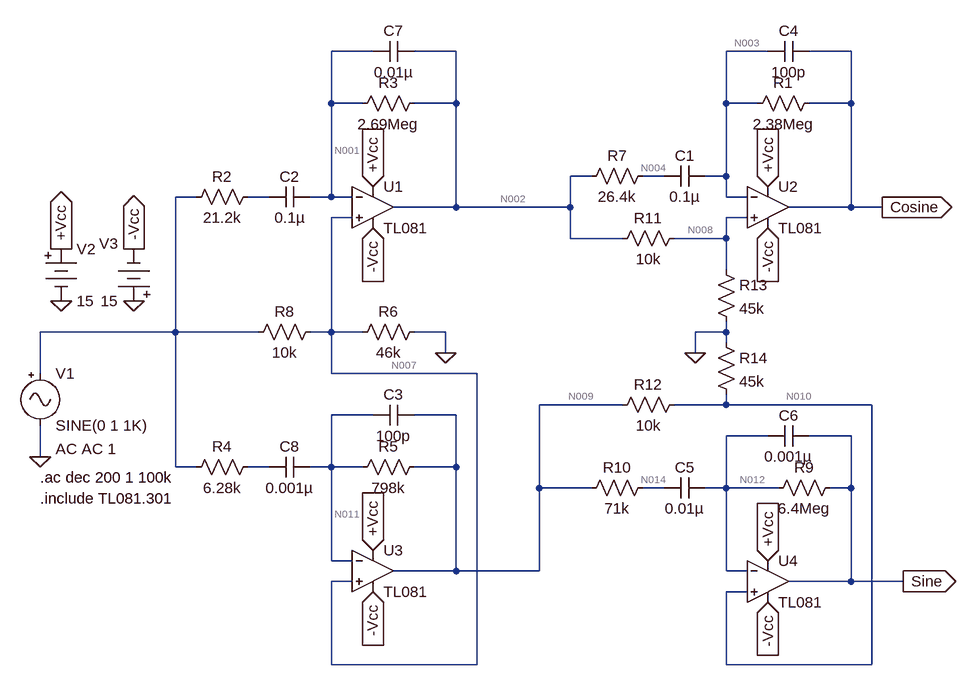
[diagram p0: schematic Second-Order Lloyd All-Pass.asc]
Second-Order Lloyd All-Pass.asc, the LTspice schematic file:
Version 4
SHEET 1 1304 1024
WIRE 32 -112 -32 -112
WIRE 160 -112 96 -112
WIRE 640 -112 576 -112
WIRE 768 -112 704 -112
WIRE -32 -32 -32 -112
WIRE 16 -32 -32 -32
WIRE 160 -32 160 -112
WIRE 160 -32 96 -32
WIRE 576 -32 576 -112
WIRE 624 -32 576 -32
WIRE 768 -32 768 -112
WIRE 768 -32 704 -32
WIRE 368 80 336 80
WIRE 480 80 448 80
WIRE 576 80 576 -32
WIRE 576 80 544 80
WIRE -240 112 -272 112
WIRE -128 112 -160 112
WIRE -32 112 -32 -32
WIRE -32 112 -64 112
WIRE 0 112 -32 112
WIRE 576 112 576 80
WIRE 608 112 576 112
WIRE 160 128 160 -32
WIRE 160 128 64 128
WIRE 336 128 336 80
WIRE 336 128 160 128
WIRE 768 128 768 -32
WIRE 768 128 672 128
WIRE 816 128 768 128
WIRE 0 144 -32 144
WIRE 608 144 576 144
WIRE 336 176 336 128
WIRE 416 176 336 176
WIRE 576 176 576 144
WIRE 576 176 496 176
WIRE 576 224 576 176
WIRE -272 320 -272 112
WIRE -272 320 -480 320
WIRE -144 320 -272 320
WIRE -32 320 -32 144
WIRE -32 320 -64 320
WIRE 16 320 -32 320
WIRE 144 320 96 320
WIRE 576 320 576 304
WIRE 576 320 528 320
WIRE 576 336 576 320
WIRE 144 352 144 320
WIRE 528 352 528 320
WIRE -480 384 -480 320
WIRE -32 384 -32 320
WIRE 192 384 -32 384
WIRE 416 432 288 432
WIRE 576 432 576 416
WIRE 576 432 496 432
WIRE 800 432 576 432
WIRE 32 448 -32 448
WIRE 160 448 96 448
WIRE 640 480 576 480
WIRE 768 480 704 480
WIRE -480 512 -480 464
WIRE -272 528 -272 320
WIRE -240 528 -272 528
WIRE -128 528 -160 528
WIRE -32 528 -32 448
WIRE -32 528 -64 528
WIRE 16 528 -32 528
WIRE 160 528 160 448
WIRE 160 528 96 528
WIRE 288 560 288 432
WIRE 368 560 288 560
WIRE 480 560 448 560
WIRE 576 560 576 480
WIRE 576 560 544 560
WIRE 656 560 576 560
WIRE 768 560 768 480
WIRE 768 560 736 560
WIRE -32 672 -32 528
WIRE 0 672 -32 672
WIRE 160 688 160 528
WIRE 160 688 64 688
WIRE 288 688 288 560
WIRE 288 688 160 688
WIRE 576 688 576 560
WIRE 608 688 576 688
WIRE 0 704 -32 704
WIRE 768 704 768 560
WIRE 768 704 672 704
WIRE 848 704 768 704
WIRE 608 720 576 720
WIRE -32 832 -32 704
WIRE 192 832 192 384
WIRE 192 832 -32 832
WIRE 576 832 576 720
WIRE 800 832 800 432
WIRE 800 832 576 832
FLAG 32 96 +Vcc
IOPIN 32 96 In
FLAG 32 160 -Vcc
IOPIN 32 160 In
FLAG -480 512 0
FLAG 32 656 +Vcc
IOPIN 32 656 In
FLAG 32 720 -Vcc
IOPIN 32 720 In
FLAG 848 704 Sine
IOPIN 848 704 Out
FLAG 816 128 Cosine
IOPIN 816 128 Out
FLAG -448 192 +Vcc
IOPIN -448 192 Out
FLAG -336 192 -Vcc
IOPIN -336 192 Out
FLAG -336 272 0
FLAG -448 272 0
FLAG 144 352 0
FLAG 640 96 +Vcc
IOPIN 640 96 In
FLAG 640 160 -Vcc
IOPIN 640 160 In
FLAG 640 672 +Vcc
IOPIN 640 672 In
FLAG 640 736 -Vcc
IOPIN 640 736 In
FLAG 528 352 0
SYMBOL OpAmps\\opamp2 32 64 R0
SYMATTR InstName U1
SYMATTR Value TL081
SYMBOL res 112 -48 R90
WINDOW 0 0 56 VBottom 2
WINDOW 3 32 56 VTop 2
SYMATTR InstName R3
SYMATTR Value 2.69Meg
SYMBOL Misc\\signal -480 368 R0
WINDOW 123 24 132 Left 2
WINDOW 39 0 0 Left 0
SYMATTR Value2 AC AC 1
SYMATTR InstName V1
SYMBOL res 112 304 R90
WINDOW 0 0 56 VBottom 2
WINDOW 3 32 56 VTop 2
SYMATTR InstName R6
SYMATTR Value 46k
SYMBOL res -48 304 R90
WINDOW 0 0 56 VBottom 2
WINDOW 3 32 56 VTop 2
SYMATTR InstName R8
SYMATTR Value 10k
SYMBOL Misc\\battery -448 176 R0
WINDOW 123 0 0 Left 0
WINDOW 39 0 0 Left 0
SYMATTR InstName V2
SYMATTR Value 15
SYMBOL Misc\\battery -336 288 R180
WINDOW 0 24 104 Left 2
WINDOW 3 24 16 Left 2
WINDOW 123 0 0 Left 0
WINDOW 39 0 0 Left 0
SYMATTR InstName V3
SYMATTR Value 15
SYMBOL cap -64 96 R90
WINDOW 0 0 32 VBottom 2
WINDOW 3 32 32 VTop 2
SYMATTR InstName C2
SYMATTR Value 0.1µ
SYMBOL res -144 96 R90
WINDOW 0 0 56 VBottom 2
WINDOW 3 32 56 VTop 2
SYMATTR InstName R2
SYMATTR Value 21.2k
SYMBOL cap 96 -128 R90
WINDOW 0 0 32 VBottom 2
WINDOW 3 32 32 VTop 2
SYMATTR InstName C7
SYMATTR Value 0.01µ
SYMBOL cap -64 512 R90
WINDOW 0 0 32 VBottom 2
WINDOW 3 32 32 VTop 2
SYMATTR InstName C8
SYMATTR Value 0.001µ
SYMBOL res -144 512 R90
WINDOW 0 0 56 VBottom 2
WINDOW 3 32 56 VTop 2
SYMATTR InstName R4
SYMATTR Value 6.28k
SYMBOL res 112 512 R90
WINDOW 0 0 56 VBottom 2
WINDOW 3 32 56 VTop 2
SYMATTR InstName R5
SYMATTR Value 798k
SYMBOL cap 96 432 R90
WINDOW 0 0 32 VBottom 2
WINDOW 3 32 32 VTop 2
SYMATTR InstName C3
SYMATTR Value 100p
SYMBOL OpAmps\\opamp2 640 64 R0
SYMATTR InstName U2
SYMATTR Value TL081
SYMBOL res 720 -48 R90
WINDOW 0 0 56 VBottom 2
WINDOW 3 32 56 VTop 2
SYMATTR InstName R1
SYMATTR Value 2.38Meg
SYMBOL cap 544 64 R90
WINDOW 0 0 32 VBottom 2
WINDOW 3 32 32 VTop 2
SYMATTR InstName C1
SYMATTR Value 0.1µ
SYMBOL res 464 64 R90
WINDOW 0 0 56 VBottom 2
WINDOW 3 32 56 VTop 2
SYMATTR InstName R7
SYMATTR Value 26.4k
SYMBOL res 512 160 R90
WINDOW 0 0 56 VBottom 2
WINDOW 3 32 56 VTop 2
SYMATTR InstName R11
SYMATTR Value 10k
SYMBOL res 752 544 R90
WINDOW 0 0 56 VBottom 2
WINDOW 3 32 56 VTop 2
SYMATTR InstName R9
SYMATTR Value 6.4Meg
SYMBOL cap 704 464 R90
WINDOW 0 0 32 VBottom 2
WINDOW 3 32 32 VTop 2
SYMATTR InstName C6
SYMATTR Value 0.001µ
SYMBOL cap 544 544 R90
WINDOW 0 0 32 VBottom 2
WINDOW 3 32 32 VTop 2
SYMATTR InstName C5
SYMATTR Value 0.01µ
SYMBOL res 464 544 R90
WINDOW 0 0 56 VBottom 2
WINDOW 3 32 56 VTop 2
SYMATTR InstName R10
SYMATTR Value 71k
SYMBOL res 512 416 R90
WINDOW 0 0 56 VBottom 2
WINDOW 3 32 56 VTop 2
SYMATTR InstName R12
SYMATTR Value 10k
SYMBOL res 560 208 R0
SYMATTR InstName R13
SYMATTR Value 45k
SYMBOL res 560 320 R0
SYMATTR InstName R14
SYMATTR Value 45k
SYMBOL cap 704 -128 R90
WINDOW 0 0 32 VBottom 2
WINDOW 3 32 32 VTop 2
SYMATTR InstName C4
SYMATTR Value 100p
SYMBOL OpAmps\\opamp2 32 624 R0
SYMATTR InstName U3
SYMATTR Value TL081
SYMBOL OpAmps\\opamp2 640 640 R0
SYMATTR InstName U4
SYMATTR Value TL081
TEXT -480 576 Left 2 !.include TL081.301
TEXT -480 544 Left 2 !.ac dec 200 1 100k

The netlist it stands for:
* Second-Order Lloyd All-Pass.asc
XU1 N007 N001 +Vcc -Vcc N002 TL081  ; pins In+ In- V+ V- OUT
R3 N002 N001 2.69Meg
V1 N005 0 SINE(0 1 1K) AC AC 1
R6 0 N007 46k
R8 N007 N005 10k
V2 +Vcc 0 15
V3 0 -Vcc 15
C2 N001 N006 0.1µ
R2 N006 N005 21.2k
C7 N002 N001 0.01µ
C8 N011 N013 0.001µ
R4 N013 N005 6.28k
R5 N009 N011 798k
C3 N009 N011 100p
XU2 N008 N003 +Vcc -Vcc Cosine TL081  ; pins In+ In- V+ V- OUT
R1 Cosine N003 2.38Meg
C1 N003 N004 0.1µ
R7 N004 N002 26.4k
R11 N008 N002 10k
R9 Sine N012 6.4Meg
C6 Sine N012 0.001µ
C5 N012 N014 0.01µ
R10 N014 N009 71k
R12 N010 N009 10k
R13 N008 0 45k
R14 0 N010 45k
C4 Cosine N003 100p
XU3 N007 N011 +Vcc -Vcc N009 TL081  ; pins In+ In- V+ V- OUT
XU4 N010 N012 +Vcc -Vcc Sine TL081  ; pins In+ In- V+ V- OUT
.include TL081.301
.ac dec 200 1 100k
.backanno
.end

* Results of the author's LTspice run, read from the files saved beside the schematic
* Operating Point, zero values left out:
*   V(n002) = 131.4 µV
*   V(-vcc) = -15 V
*   V(+vcc) = 15 V
*   V(n001) = 10.23 µV
*   V(n007) = -740.2 nV
*   V(n011) = 10.23 µV
*   V(n009) = 46.18 µV
*   V(cosine) = 225.4 µV
*   V(n003) = 118.1 µV
*   V(n008) = 107.2 µV
*   V(n004) = 131.4 µV
*   V(sine) = 336.7 µV
*   V(n012) = 48.39 µV
*   V(n014) = 46.18 µV
*   V(n010) = 37.42 µV
*   I(R3) = 45.05 pA
*   I(R6) = 16.09 pA
*   I(R8) = -74.02 pA
*   I(R5) = 45.05 pA
*   I(R1) = 45.05 pA
*   I(R11) = -2.426 nA
*   I(R9) = 45.05 pA
*   I(R12) = -876.5 pA
*   I(R13) = 2.381 nA
*   I(R14) = -831.5 pA
*   I(V1) = -74.02 pA
*   I(V2) = -56.78 mA
*   I(V3) = -56.78 mA
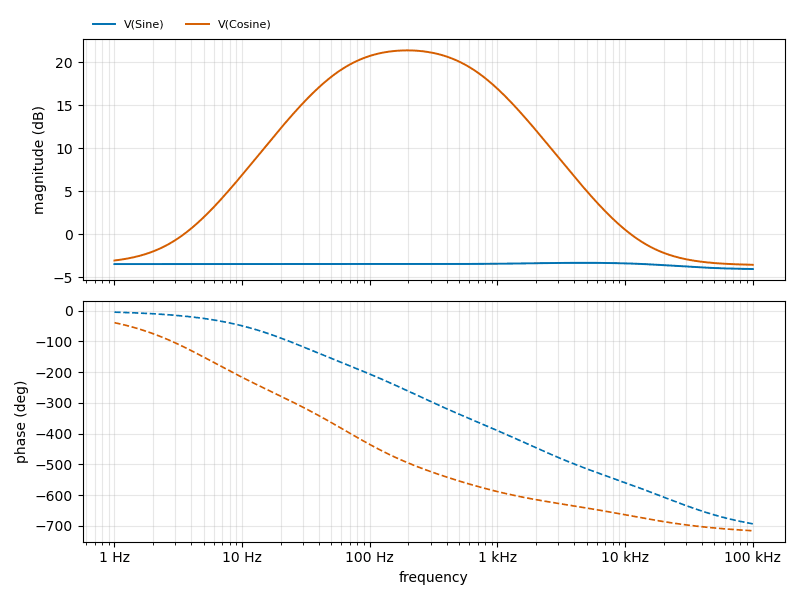
[diagram p1: AC Analysis of Second-Order Lloyd All-Pass.asc, plotted from the saved traces]
* AC Analysis, 1 run:
*   V(Sine): -3.45 dB at 1 Hz, -4.03 dB at 100 kHz, peak -3.31 dB at 4.624 kHz
*   V(Cosine): -3.04 dB at 1 Hz, -3.54 dB at 100 kHz, peak 21.36 dB at 197.2 Hz, 3 dB below the peak at 50.54 Hz and 767.6 Hz